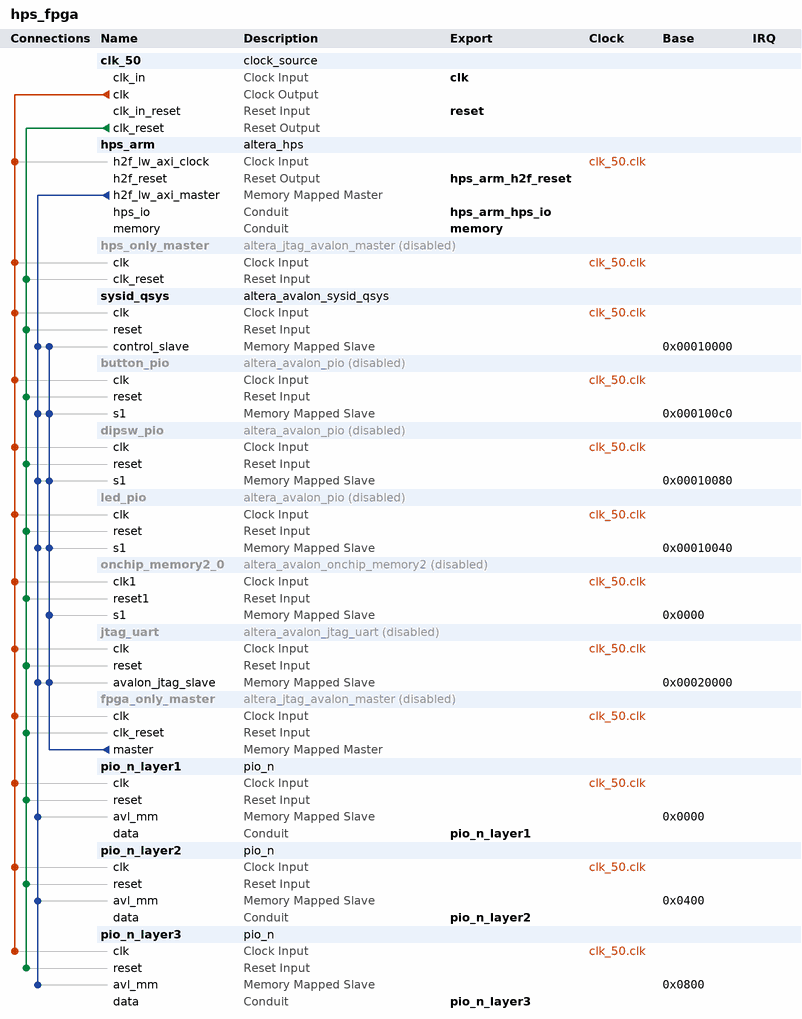
[diagram p0: system contents]
# Platform Designer (Qsys) system hps_fpga, Cyclone V 5CSEMA4U23C6
# Parameters at their usual value, and those the tool derives, are not listed.
package require -exact qsys 16.1
create_system hps_fpga
set_project_property DEVICE_FAMILY {Cyclone V}
set_project_property DEVICE 5CSEMA4U23C6

add_instance clk_50 clock_source 16.1
set_instance_parameter_value clk_50 clockFrequency 50000000

add_instance hps_arm altera_hps 16.1
set_instance_parameter_value hps_arm EMAC1_Mode RGMII
set_instance_parameter_value hps_arm EMAC1_PinMuxing {HPS I/O Set 0}
set_instance_parameter_value hps_arm F2SCLK_COLDRST_Enable false
set_instance_parameter_value hps_arm F2SCLK_DBGRST_Enable false
set_instance_parameter_value hps_arm F2SCLK_WARMRST_Enable false
set_instance_parameter_value hps_arm F2SINTERRUPT_Enable false
set_instance_parameter_value hps_arm F2S_Width 0
set_instance_parameter_value hps_arm FPGA_PERIPHERAL_OUTPUT_CLOCK_FREQ_EMAC0_GTX_CLK 100
set_instance_parameter_value hps_arm FPGA_PERIPHERAL_OUTPUT_CLOCK_FREQ_EMAC0_MD_CLK 100.0
set_instance_parameter_value hps_arm FPGA_PERIPHERAL_OUTPUT_CLOCK_FREQ_EMAC1_GTX_CLK 100
set_instance_parameter_value hps_arm FPGA_PERIPHERAL_OUTPUT_CLOCK_FREQ_EMAC1_MD_CLK 100.0
set_instance_parameter_value hps_arm HPS_PROTOCOL DDR3
set_instance_parameter_value hps_arm I2C0_Mode I2C
set_instance_parameter_value hps_arm I2C0_PinMuxing {HPS I/O Set 0}
set_instance_parameter_value hps_arm I2C1_Mode I2C
set_instance_parameter_value hps_arm I2C1_PinMuxing {HPS I/O Set 0}
set_instance_parameter_value hps_arm LWH2F_Enable true
set_instance_parameter_value hps_arm MEM_BANKADDR_WIDTH 3
set_instance_parameter_value hps_arm MEM_CLK_FREQ 400.0
set_instance_parameter_value hps_arm MEM_COL_ADDR_WIDTH 10
set_instance_parameter_value hps_arm MEM_DQ_WIDTH 32
set_instance_parameter_value hps_arm MEM_DRV_STR RZQ/6
set_instance_parameter_value hps_arm MEM_ROW_ADDR_WIDTH 15
set_instance_parameter_value hps_arm MEM_RTT_NOM RZQ/6
set_instance_parameter_value hps_arm MEM_RTT_WR {Dynamic ODT off}
set_instance_parameter_value hps_arm MEM_TCL 7
set_instance_parameter_value hps_arm MEM_TFAW_NS 37.5
set_instance_parameter_value hps_arm MEM_TRAS_NS 35.0
set_instance_parameter_value hps_arm MEM_TRCD_NS 13.75
set_instance_parameter_value hps_arm MEM_TRFC_NS 300.0
set_instance_parameter_value hps_arm MEM_TRP_NS 13.75
set_instance_parameter_value hps_arm MEM_VENDOR Other
set_instance_parameter_value hps_arm MEM_WTCL 7
set_instance_parameter_value hps_arm QSPI_Mode N/A
set_instance_parameter_value hps_arm QSPI_PinMuxing Unused
set_instance_parameter_value hps_arm REF_CLK_FREQ 25.0
set_instance_parameter_value hps_arm S2FCLK_USER2CLK 5
set_instance_parameter_value hps_arm S2F_Width 0
set_instance_parameter_value hps_arm SDIO_Mode {4-bit Data}
set_instance_parameter_value hps_arm SDIO_PinMuxing {HPS I/O Set 0}
set_instance_parameter_value hps_arm SPIM1_Mode {Single Slave Select}
set_instance_parameter_value hps_arm SPIM1_PinMuxing {HPS I/O Set 0}
set_instance_parameter_value hps_arm STM_Enable false
set_instance_parameter_value hps_arm TIMING_BOARD_AC_SKEW 0.02
set_instance_parameter_value hps_arm TIMING_BOARD_AC_TO_CK_SKEW 0.0
set_instance_parameter_value hps_arm TIMING_BOARD_DQ_TO_DQS_SKEW 0.0
set_instance_parameter_value hps_arm TIMING_BOARD_MAX_CK_DELAY 0.6
set_instance_parameter_value hps_arm TIMING_BOARD_MAX_DQS_DELAY 0.6
set_instance_parameter_value hps_arm TIMING_BOARD_SKEW_BETWEEN_DQS 0.02
set_instance_parameter_value hps_arm TIMING_BOARD_SKEW_CKDQS_DIMM_MAX 0.01
set_instance_parameter_value hps_arm TIMING_BOARD_SKEW_CKDQS_DIMM_MIN -0.01
set_instance_parameter_value hps_arm TIMING_BOARD_SKEW_WITHIN_DQS 0.02
set_instance_parameter_value hps_arm TIMING_TDH 125
set_instance_parameter_value hps_arm TIMING_TDQSCK 400
set_instance_parameter_value hps_arm TIMING_TDQSQ 120
set_instance_parameter_value hps_arm TIMING_TDS 50
set_instance_parameter_value hps_arm TIMING_TIH 250
set_instance_parameter_value hps_arm TIMING_TIS 175
set_instance_parameter_value hps_arm TIMING_TQSH 0.38
set_instance_parameter_value hps_arm UART0_Mode {No Flow Control}
set_instance_parameter_value hps_arm UART0_PinMuxing {HPS I/O Set 0}
set_instance_parameter_value hps_arm USB1_Mode SDR
set_instance_parameter_value hps_arm USB1_PinMuxing {HPS I/O Set 0}
set_instance_parameter_value hps_arm desired_cfg_clk_mhz 100.0
set_instance_parameter_value hps_arm desired_qspi_clk_mhz 370.0

add_instance hps_only_master altera_jtag_avalon_master 16.1
set_instance_property hps_only_master ENABLED false

add_instance sysid_qsys altera_avalon_sysid_qsys 16.1
set_instance_parameter_value sysid_qsys id -1395322110

add_instance button_pio altera_avalon_pio 16.1
set_instance_property button_pio ENABLED false
set_instance_parameter_value button_pio bitClearingEdgeCapReg true
set_instance_parameter_value button_pio captureEdge true
set_instance_parameter_value button_pio direction Input
set_instance_parameter_value button_pio edgeType FALLING
set_instance_parameter_value button_pio generateIRQ true
set_instance_parameter_value button_pio irqType EDGE
set_instance_parameter_value button_pio width 4

add_instance dipsw_pio altera_avalon_pio 16.1
set_instance_property dipsw_pio ENABLED false
set_instance_parameter_value dipsw_pio bitClearingEdgeCapReg true
set_instance_parameter_value dipsw_pio captureEdge true
set_instance_parameter_value dipsw_pio direction Input
set_instance_parameter_value dipsw_pio edgeType ANY
set_instance_parameter_value dipsw_pio generateIRQ true
set_instance_parameter_value dipsw_pio irqType EDGE
set_instance_parameter_value dipsw_pio width 4

add_instance led_pio altera_avalon_pio 16.1
set_instance_property led_pio ENABLED false
set_instance_parameter_value led_pio direction Output
set_instance_parameter_value led_pio width 8

add_instance onchip_memory2_0 altera_avalon_onchip_memory2 16.1
set_instance_property onchip_memory2_0 ENABLED false
set_instance_parameter_value onchip_memory2_0 dataWidth 64
set_instance_parameter_value onchip_memory2_0 dualPort false
set_instance_parameter_value onchip_memory2_0 initMemContent true
set_instance_parameter_value onchip_memory2_0 initializationFileName onchip_memory2_0
set_instance_parameter_value onchip_memory2_0 memorySize 64

add_instance jtag_uart altera_avalon_jtag_uart 16.1
set_instance_property jtag_uart ENABLED false
set_instance_parameter_value jtag_uart allowMultipleConnections true
set_instance_parameter_value jtag_uart simInteractiveOptions INTERACTIVE_ASCII_OUTPUT

add_instance fpga_only_master altera_jtag_avalon_master 16.1
set_instance_property fpga_only_master ENABLED false

add_instance pio_n_layer1 pio_n 1.0
set_instance_parameter_value pio_n_layer1 ByteEnable false
set_instance_parameter_value pio_n_layer1 RegCnt 64

add_instance pio_n_layer2 pio_n 1.0
set_instance_parameter_value pio_n_layer2 ByteEnable false
set_instance_parameter_value pio_n_layer2 RegCnt 64

add_instance pio_n_layer3 pio_n 1.0
set_instance_parameter_value pio_n_layer3 ByteEnable false
set_instance_parameter_value pio_n_layer3 RegCnt 64

# connections
add_connection clk_50.clk button_pio.clk clock
add_connection clk_50.clk dipsw_pio.clk clock
add_connection clk_50.clk fpga_only_master.clk clock
add_connection clk_50.clk hps_arm.h2f_lw_axi_clock clock
add_connection clk_50.clk hps_only_master.clk clock
add_connection clk_50.clk jtag_uart.clk clock
add_connection clk_50.clk led_pio.clk clock
add_connection clk_50.clk onchip_memory2_0.clk1 clock
add_connection clk_50.clk pio_n_layer1.clk clock
add_connection clk_50.clk pio_n_layer2.clk clock
add_connection clk_50.clk pio_n_layer3.clk clock
add_connection clk_50.clk sysid_qsys.clk clock
add_connection clk_50.clk_reset button_pio.reset reset
add_connection clk_50.clk_reset dipsw_pio.reset reset
add_connection clk_50.clk_reset fpga_only_master.clk_reset reset
add_connection clk_50.clk_reset hps_only_master.clk_reset reset
add_connection clk_50.clk_reset jtag_uart.reset reset
add_connection clk_50.clk_reset led_pio.reset reset
add_connection clk_50.clk_reset onchip_memory2_0.reset1 reset
add_connection clk_50.clk_reset pio_n_layer1.reset reset
add_connection clk_50.clk_reset pio_n_layer2.reset reset
add_connection clk_50.clk_reset pio_n_layer3.reset reset
add_connection clk_50.clk_reset sysid_qsys.reset reset
add_connection fpga_only_master.master button_pio.s1 avalon
set_connection_parameter_value fpga_only_master.master/button_pio.s1 baseAddress 0x000100c0
add_connection fpga_only_master.master dipsw_pio.s1 avalon
set_connection_parameter_value fpga_only_master.master/dipsw_pio.s1 baseAddress 0x00010080
add_connection fpga_only_master.master jtag_uart.avalon_jtag_slave avalon
set_connection_parameter_value fpga_only_master.master/jtag_uart.avalon_jtag_slave baseAddress 0x00020000
add_connection fpga_only_master.master led_pio.s1 avalon
set_connection_parameter_value fpga_only_master.master/led_pio.s1 baseAddress 0x00010040
add_connection fpga_only_master.master onchip_memory2_0.s1 avalon
set_connection_parameter_value fpga_only_master.master/onchip_memory2_0.s1 baseAddress 0x0000
add_connection fpga_only_master.master sysid_qsys.control_slave avalon
set_connection_parameter_value fpga_only_master.master/sysid_qsys.control_slave baseAddress 0x00010000
add_connection hps_arm.h2f_lw_axi_master button_pio.s1 avalon
set_connection_parameter_value hps_arm.h2f_lw_axi_master/button_pio.s1 baseAddress 0x000100c0
add_connection hps_arm.h2f_lw_axi_master dipsw_pio.s1 avalon
set_connection_parameter_value hps_arm.h2f_lw_axi_master/dipsw_pio.s1 baseAddress 0x00010080
add_connection hps_arm.h2f_lw_axi_master jtag_uart.avalon_jtag_slave avalon
set_connection_parameter_value hps_arm.h2f_lw_axi_master/jtag_uart.avalon_jtag_slave baseAddress 0x00020000
add_connection hps_arm.h2f_lw_axi_master led_pio.s1 avalon
set_connection_parameter_value hps_arm.h2f_lw_axi_master/led_pio.s1 baseAddress 0x00010040
add_connection hps_arm.h2f_lw_axi_master pio_n_layer1.avl_mm avalon
set_connection_parameter_value hps_arm.h2f_lw_axi_master/pio_n_layer1.avl_mm baseAddress 0x0000
add_connection hps_arm.h2f_lw_axi_master pio_n_layer2.avl_mm avalon
set_connection_parameter_value hps_arm.h2f_lw_axi_master/pio_n_layer2.avl_mm baseAddress 0x0400
add_connection hps_arm.h2f_lw_axi_master pio_n_layer3.avl_mm avalon
set_connection_parameter_value hps_arm.h2f_lw_axi_master/pio_n_layer3.avl_mm baseAddress 0x0800
add_connection hps_arm.h2f_lw_axi_master sysid_qsys.control_slave avalon
set_connection_parameter_value hps_arm.h2f_lw_axi_master/sysid_qsys.control_slave baseAddress 0x00010000

# exported interfaces
add_interface clk clock sink
set_interface_property clk EXPORT_OF clk_50.clk_in
add_interface hps_arm_h2f_reset reset source
set_interface_property hps_arm_h2f_reset EXPORT_OF hps_arm.h2f_reset
add_interface hps_arm_hps_io conduit end
set_interface_property hps_arm_hps_io EXPORT_OF hps_arm.hps_io
add_interface memory conduit end
set_interface_property memory EXPORT_OF hps_arm.memory
add_interface pio_n_layer1 conduit end
set_interface_property pio_n_layer1 EXPORT_OF pio_n_layer1.data
add_interface pio_n_layer2 conduit end
set_interface_property pio_n_layer2 EXPORT_OF pio_n_layer2.data
add_interface pio_n_layer3 conduit end
set_interface_property pio_n_layer3 EXPORT_OF pio_n_layer3.data
add_interface reset reset sink
set_interface_property reset EXPORT_OF clk_50.clk_in_reset

set_interconnect_requirement {$system} qsys_mm.clockCrossingAdapter HANDSHAKE
set_interconnect_requirement {$system} qsys_mm.maxAdditionalLatency 1

save_system hps_fpga.qsys
